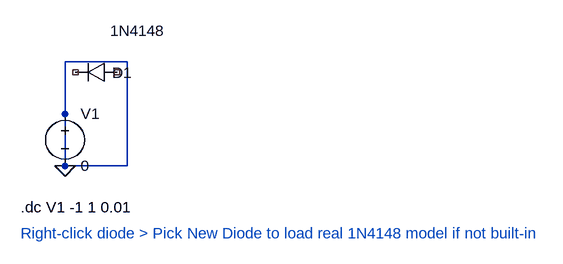
[diagram p0: schematic 06_diode_IV_curve.asc]
06_diode_IV_curve.asc, the LTspice schematic file:
Version 4
SHEET 1 880 680
WIRE 224 96 128 96
WIRE 128 176 128 96
WIRE 224 176 224 96
WIRE 128 256 128 176
WIRE 224 256 224 176
WIRE 224 256 128 256
FLAG 128 256 0
SYMBOL voltage 128 160 R0
SYMATTR InstName V1
SYMATTR Value 0
SYMBOL diode 208 96 R90
WINDOW 0 32 -8 VBottom 2
WINDOW 3 -32 -32 VBottom 2
SYMATTR InstName D1
SYMATTR Value 1N4148
TEXT 60 320 Left 2 !.dc V1 -1 1 0.01
TEXT 60 360 Left 2 ;Right-click diode > Pick New Diode to load real 1N4148 model if not built-in

The netlist it stands for:
* 06_diode_IV_curve.asc
V1 0 0 0
D1 NC_01 NC_02 1N4148
.model D D
.lib standard.dio
.dc V1 -1 1 0.01
* Right-click diode > Pick New Diode to load real 1N4148 model if not built-in
.backanno
.end